# Altium project ecg-go_core.PrjPCB
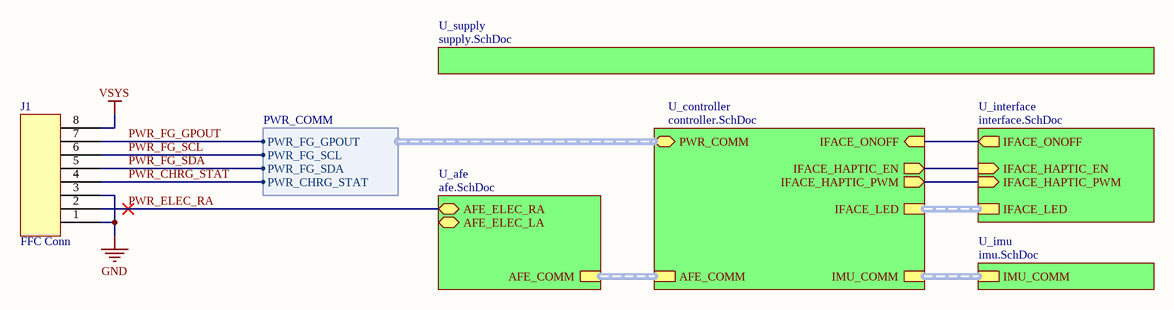
[diagram p0: core.SchDoc]
6 sheets, 84 parts. Net scope: hierarchical (ports join the sheet entries above them; power ports are global).
Board file: ecg-go_core.PcbDoc
Sheets:
  core.SchDoc
    U_afe = afe.SchDoc
    U_controller = controller.SchDoc
    U_imu = imu.SchDoc
    U_interface = interface.SchDoc
    U_supply = supply.SchDoc

## Sheet core.SchDoc: Core
size A4; Author: Samuel López; DocumentNumber: 1; SheetNumber: 1; SheetTotal: 6

### Parts
J1  FFC Conn  [WE68610814122]

### Sub-sheets
U_afe = afe.SchDoc: AFE_COMM (harness AFE_COMM), AFE_ELEC_RA (bidir), AFE_ELEC_LA (bidir)
U_controller = controller.SchDoc: IFACE_HAPTIC_EN (out), IFACE_HAPTIC_PWM (out), IFACE_ONOFF (in), IFACE_LED (harness IFACE_LED), AFE_COMM (harness AFE_COMM), IMU_COMM (harness IMU_COMM), PWR_COMM (harness PWR_COMM)
U_imu = imu.SchDoc: IMU_COMM (harness IMU_COMM)
U_interface = interface.SchDoc: IFACE_LED (harness IFACE_LED), IFACE_ONOFF (out), IFACE_HAPTIC_EN (in), IFACE_HAPTIC_PWM (in)
U_supply = supply.SchDoc: no entries

### Harnesses
PWR_COMM: PWR_FG_GPOUT, PWR_FG_SCL, PWR_FG_SDA, PWR_CHRG_STAT

### Nets
GND: J1.1 J1.3  [project net AGND]
VSYS: J1.8
IFACE_HAPTIC_EN: sheet U_controller/IFACE_HAPTIC_EN, sheet U_interface/IFACE_HAPTIC_EN
IFACE_HAPTIC_PWM: sheet U_controller/IFACE_HAPTIC_PWM, sheet U_interface/IFACE_HAPTIC_PWM
IFACE_ONOFF: sheet U_controller/IFACE_ONOFF, sheet U_interface/IFACE_ONOFF
PWR_CHRG_STAT: J1.4 ; sheet U_controller/PWR_COMM.PWR_CHRG_STAT
PWR_ELEC_RA: J1.2 ; sheet U_afe/AFE_ELEC_RA  [project net AFE_ELEC_RA]
PWR_FG_GPOUT: J1.7 ; sheet U_controller/PWR_COMM.PWR_FG_GPOUT
PWR_FG_SCL: J1.6 ; sheet U_controller/PWR_COMM.PWR_FG_SCL
PWR_FG_SDA: J1.5 ; sheet U_controller/PWR_COMM.PWR_FG_SDA

### Buses and harness runs
harness sheet U_afe/AFE_COMM = sheet U_controller/AFE_COMM
harness sheet U_controller/IFACE_LED = sheet U_interface/IFACE_LED
harness sheet U_controller/IMU_COMM = sheet U_imu/IMU_COMM

### Notes on the sheet
- Title:
- Sheet
- of
- Author:
- Date:
- Time:

### Library data of the parts
J1 = WE68610814122: Conn - FFC, 8 Pin, 1 mm Pitch, Top Contacts, SMD, Right Angle, Slide Lock; Supplier 1: Digi-Key; Supplier Part Number 1: 732-2003-1-ND

## Sheet afe.SchDoc: AFE
size A4; Author: Samuel López; DocumentNumber: 3; SheetNumber: 3; SheetTotal: 6
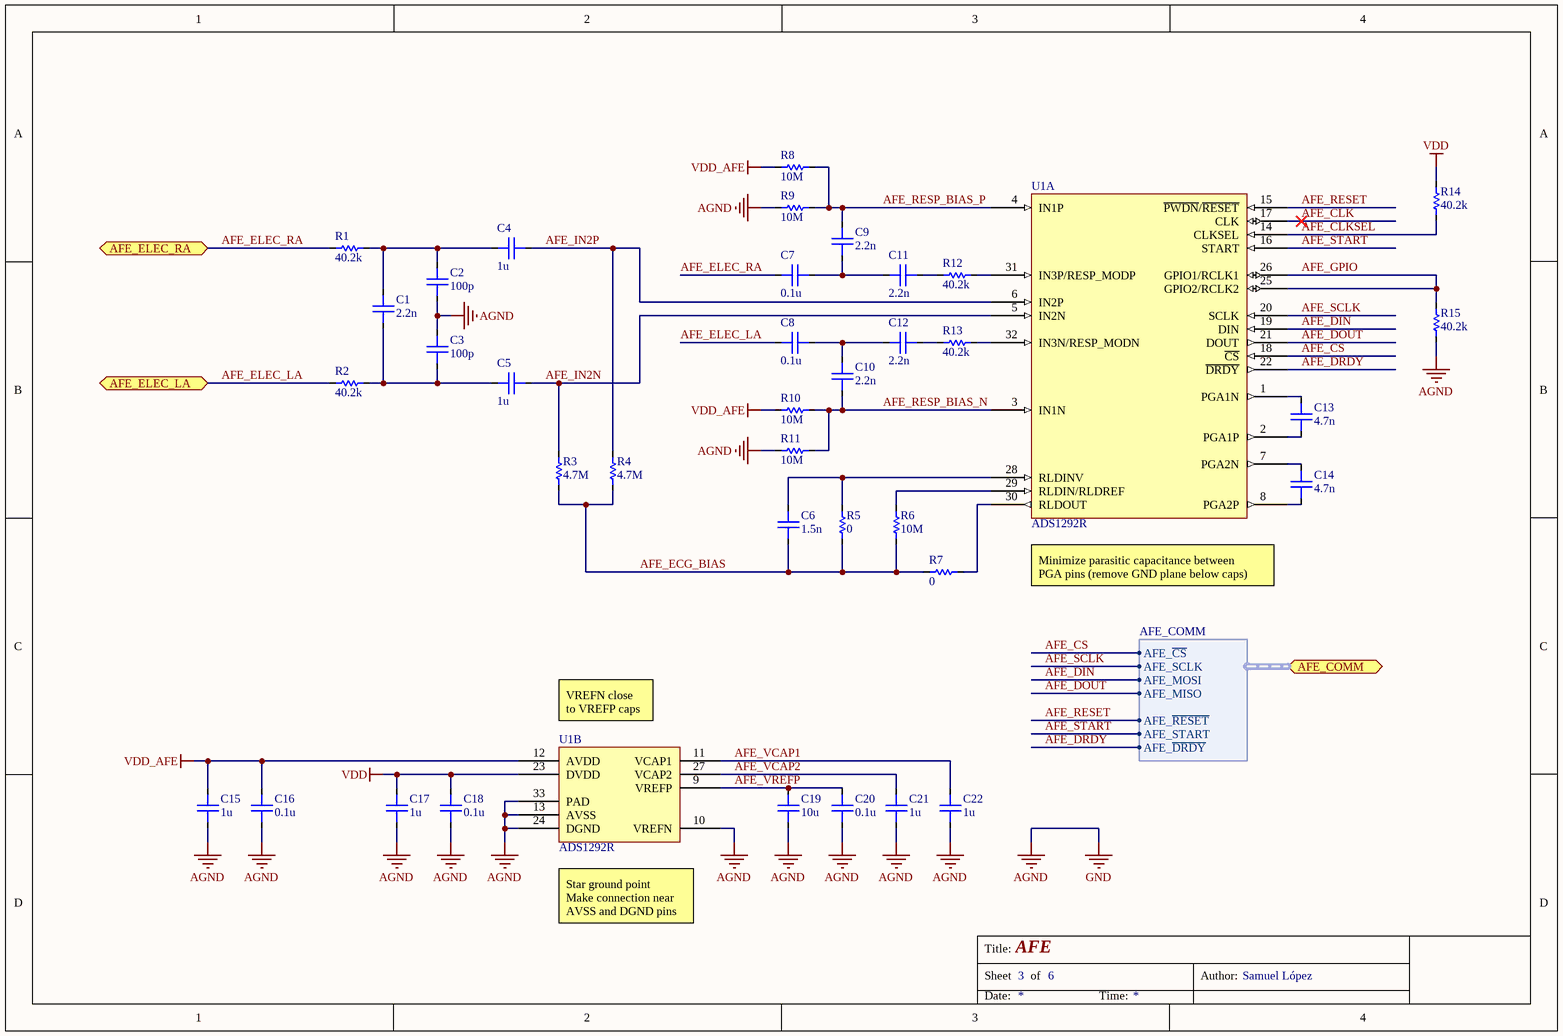
[diagram p1: afe.SchDoc]

### Parts
C1  2.2n  [C0402]
C2  100p  [C0402]
C3  100p  [C0402]
C4  1u  [C0402]
C5  1u  [C0402]
C6  1.5n  [C0402]
C7  0.1u  [C0402]
C8  0.1u  [C0402]
C9  2.2n  [C0402]
C10  2.2n  [C0402]
C11  2.2n  [C0402]
C12  2.2n  [C0402]
C13  4.7n  [C0402]
C14  4.7n  [C0402]
C15  1u  [C0402]
C16  0.1u  [C0402]
C17  1u  [C0402]
C18  0.1u  [C0402]
C19  10u  [C0603]
C20  0.1u  [C0402]
C21  1u  [C0402]
C22  1u  [C0402]
R1  40.2k  [R0402]
R2  40.2k  [R0402]
R3  4.7M  [R0402]
R4  4.7M  [R0402]
R5  0  [R0402]
R6  10M  [R0402]
R7  0  [R0402]
R8  10M  [R0402]
R9  10M  [R0402]
R10  10M  [R0402]
R11  10M  [R0402]
R12  40.2k  [R0402]
R13  40.2k  [R0402]
R14  40.2k  [R0402]
R15  40.2k  [R0402]
U1  ADS1292R  [ADS129x_QFN]  (parts A,B of 2)

### Ports
AFE_COMM (harness AFE_COMM), AFE_ELEC_LA (bidir), AFE_ELEC_RA (bidir)

### Harnesses
AFE_COMM: AFE_SCLK, AFE_MOSI, AFE_MISO, AFE_~{CS}, AFE_~{RESET}, AFE_START, AFE_~{DRDY}

### Nets
AGND: C2.2 C3.1 C15.1 C16.1 C17.1 C18.1 C19.1 C20.1 C21.1 C22.1 R9.2 R11.2 R15.1 U1.10(VREFN) U1.13(AVSS) U1.24(DGND) U1.33(PAD)  [also labelled GND]
VDD: C17.2 C18.2 R14.2 U1.23(DVDD)
VDD_AFE: C15.2 C16.2 R8.2 R10.2 U1.12(AVDD)
AFE_CLK: U1.17(CLK)
AFE_CLKSEL: R14.1 U1.14(CLKSEL)
AFE_CS: U1.18(~{CS}) ; port AFE_COMM.AFE_~{CS}
AFE_DIN: U1.19(DIN) ; port AFE_COMM.AFE_MOSI
AFE_DOUT: U1.21(DOUT) ; port AFE_COMM.AFE_MISO
AFE_DRDY: U1.22(~{DRDY}) ; port AFE_COMM.AFE_~{DRDY}
AFE_ECG_BIAS: C6.1 R3.1 R4.1 R5.1 R6.1 R7.2
AFE_ELEC_LA: C8.1 R2.2 ; port AFE_ELEC_LA
AFE_ELEC_RA: C7.2 R1.2 ; port AFE_ELEC_RA
AFE_GPIO: R15.2 U1.25(GPIO2/RCLK2) U1.26(GPIO1/RCLK1)
AFE_IN2N: C5.2 R3.2 U1.5(IN2N)
AFE_IN2P: C4.2 R4.2 U1.6(IN2P)
AFE_RESET: U1.15(~{PWDN}/~{RESET}) ; port AFE_COMM.AFE_~{RESET}
AFE_RESP_BIAS_N: C10.1 R10.1 R11.1 U1.3(IN1N)
AFE_RESP_BIAS_P: C9.1 R8.1 R9.1 U1.4(IN1P)
AFE_SCLK: U1.20(SCLK) ; port AFE_COMM.AFE_SCLK
AFE_START: U1.16(START) ; port AFE_COMM.AFE_START
AFE_VCAP1: C22.2 U1.11(VCAP1)
AFE_VCAP2: C21.2 U1.27(VCAP2)
AFE_VREFP: C19.2 C20.2 U1.9(VREFP)
NetC1_1: C1.1 C2.1 C4.1 R1.1
NetC1_2: C1.2 C3.2 C5.1 R2.1
NetC6_2: C6.2 R5.2 U1.28(RLDINV)
NetC7_1: C7.1 C9.2 C11.2
NetC8_2: C8.2 C10.2 C12.1
NetC11_1: C11.1 R12.2
NetC12_2: C12.2 R13.2
NetC13_1: C13.1 U1.2(PGA1P)
NetC13_2: C13.2 U1.1(PGA1N)
NetC14_1: C14.1 U1.8(PGA2P)
NetC14_2: C14.2 U1.7(PGA2N)
NetR6_2: R6.2 U1.29(RLDIN/RLDREF)
NetR7_1: R7.1 U1.30(RLDOUT)
NetR12_1: R12.1 U1.31(IN3P/RESP_MODP)
NetR13_1: R13.1 U1.32(IN3N/RESP_MODN)

### Notes on the sheet
- Minimize parasitic capacitance between
  PGA pins (remove GND plane below caps)
- (near U1) VREFN close
  to VREFP caps
- (near U1) Star ground point
  Make connection near AVSS and DGND pins
- Title:
- Sheet
- of
- Author:
- Date:
- Time:

### Library data of the parts
C1-C22 = Capacitor: Rated Voltage: *
  C1 C9-C12: Value: 2.2n
  C2 C3: Value: 100p
  C4 C5 C15 C17 C21 C22: Value: 1u
  C6: Value: 1.5n
  C7 C8 C16 C18 C20: Value: 0.1u
  C13 C14: Value: 4.7n
  C19: Value: 10u
R1-R15 = Resistor: Power: *
  R1 R2 R12-R15: Value: 40.2k
  R3 R4: Value: 4.7M
  R5 R7: Value: 0
  R6 R8-R11: Value: 10M
U1 = ADS1292R: IC - Analog Front End - Medical; Supplier 1: Digi-Key; Supplier Part Number 1: 296-35020-1-ND

## Sheet controller.SchDoc: Controller
size A4; Author: Samuel López; DocumentNumber: 2; SheetNumber: 2; SheetTotal: 6
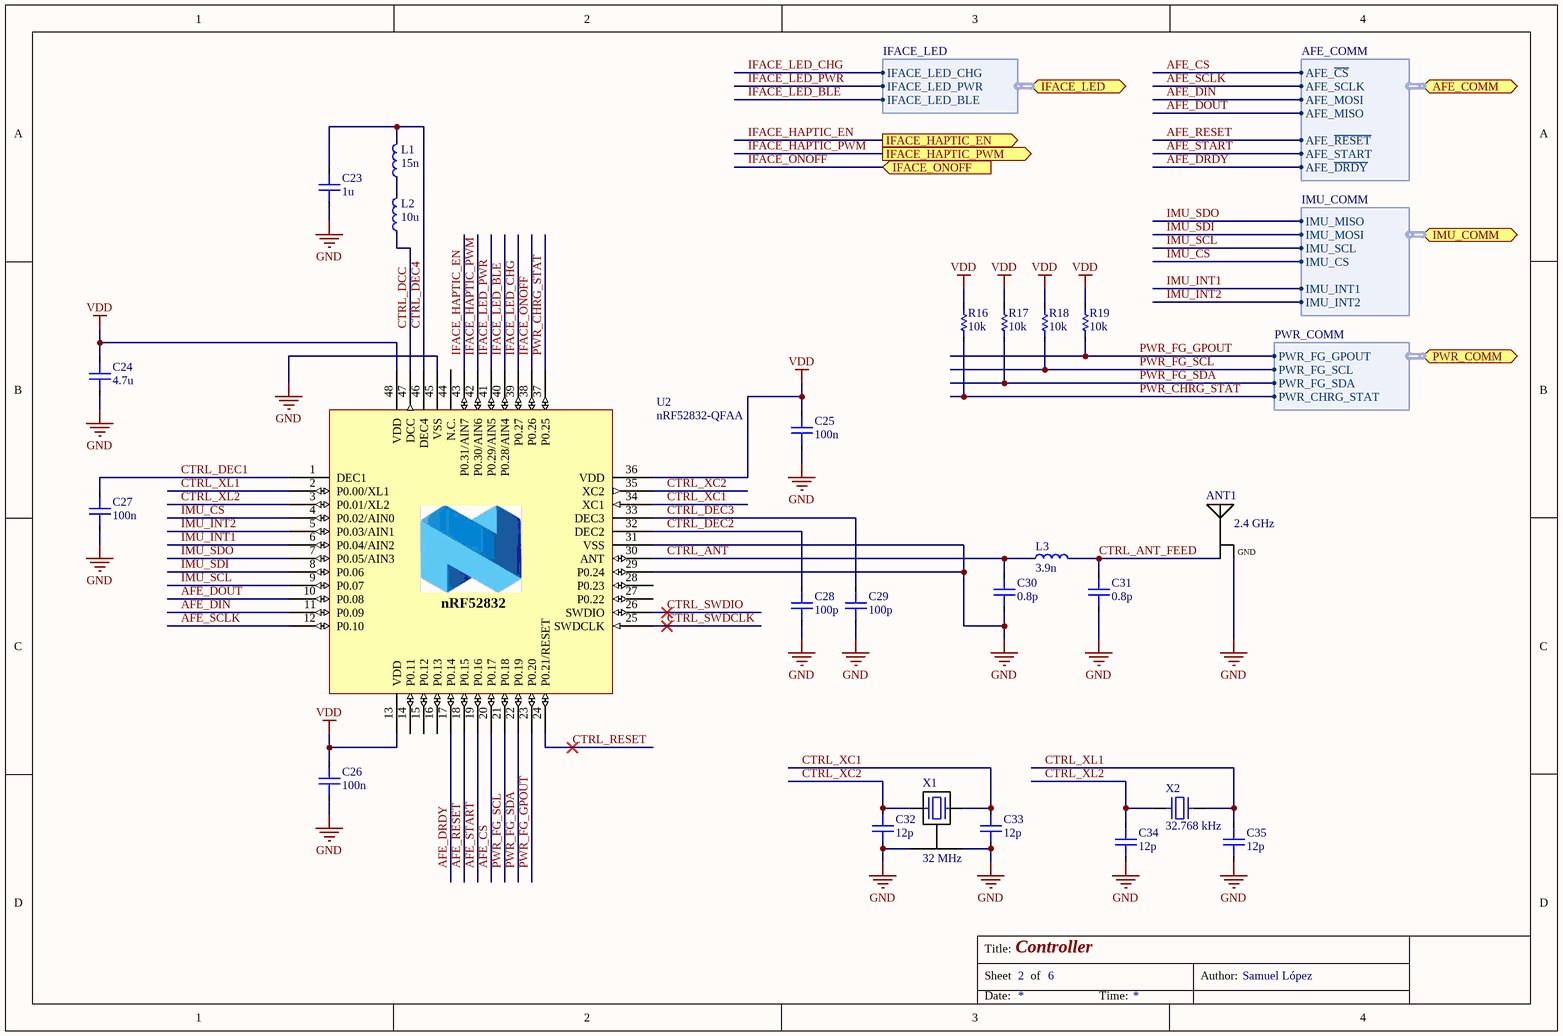
[diagram p2: controller.SchDoc]

### Parts
ANT1  2.4 GHz  [ANT2.4GHZ_MIFA]  (net tie, no BOM)
C23  1u  [C0402]
C24  4.7u  [C0603]
C25  100n  [C0402]
C26  100n  [C0402]
C27  100n  [C0402]
C28  100p  [C0402]
C29  100p  [C0402]
C30  0.8p  [C0402]
C31  0.8p  [C0402]
C32  12p  [C0402]
C33  12p  [C0402]
C34  12p  [C0402]
C35  12p  [C0402]
L1  15n  [L0402]
L2  10u  [L0603]
L3  3.9n  [L0402]
R16  10k  [R0402]
R17  10k  [R0402]
R18  10k  [R0402]
R19  10k  [R0402]
U2  nRF52832-QFAA  [QFN40P600X600X90-48N]
X1  32 MHz  [CX2016DB32000D0FLJCC]
X2  32.768 kHz  [ABS07-32.768KHZ-9-T]

### Ports
AFE_COMM (harness AFE_COMM), IFACE_HAPTIC_EN (out), IFACE_HAPTIC_PWM (out), IFACE_LED (harness IFACE_LED), IFACE_ONOFF (in), IMU_COMM (harness IMU_COMM), PWR_COMM (harness PWR_COMM)

### Harnesses
IFACE_LED: IFACE_LED_CHG, IFACE_LED_PWR, IFACE_LED_BLE
AFE_COMM: AFE_SCLK, AFE_MOSI, AFE_MISO, AFE_~{CS}, AFE_~{RESET}, AFE_START, AFE_~{DRDY}
IMU_COMM: IMU_SCL, IMU_MOSI, IMU_MISO, IMU_CS, IMU_INT1, IMU_INT2
PWR_COMM: PWR_FG_GPOUT, PWR_FG_SCL, PWR_FG_SDA, PWR_CHRG_STAT

### Nets
GND: ANT1.2(GND) C23.1 C24.1 C25.1 C26.1 C27.1 C28.1 C29.1 C30.2 C31.2 C32.1 C33.1 C34.1 C35.1 U2.29(P0.24) U2.31(VSS) U2.45(VSS) U2.49(GND) X1.2 X1.4  [project net AGND]
VDD: C24.2 C25.2 C26.2 R16.2 R17.2 R18.2 R19.2 U2.13(VDD) U2.36(VDD) U2.48(VDD)
AFE_CS: U2.20(P0.17) ; port AFE_COMM.AFE_~{CS}
AFE_DIN: U2.11(P0.09) ; port AFE_COMM.AFE_MOSI
AFE_DOUT: U2.10(P0.08) ; port AFE_COMM.AFE_MISO
AFE_DRDY: U2.17(P0.14) ; port AFE_COMM.AFE_~{DRDY}
AFE_RESET: U2.18(P0.15) ; port AFE_COMM.AFE_~{RESET}
AFE_SCLK: U2.12(P0.10) ; port AFE_COMM.AFE_SCLK
AFE_START: U2.19(P0.16) ; port AFE_COMM.AFE_START
CTRL_ANT: C30.1 L3.1 U2.30(ANT)
CTRL_ANT_FEED: ANT1.1(IN) C31.1 L3.2
CTRL_DCC: L2.1 U2.47(DCC)
CTRL_DEC1: C27.2 U2.1(DEC1)
CTRL_DEC2: C28.2 U2.32(DEC2)
CTRL_DEC3: C29.2 U2.33(DEC3)
CTRL_DEC4: C23.2 L1.2 U2.46(DEC4)
CTRL_RESET: U2.24(P0.21/RESET)
CTRL_SWDCLK: U2.25(SWDCLK)
CTRL_SWDIO: U2.26(SWDIO)
CTRL_XC1: C33.2 U2.34(XC1) X1.3
CTRL_XC2: C32.2 U2.35(XC2) X1.1
CTRL_XL1: C35.2 U2.2(P0.00/XL1) X2.2
CTRL_XL2: C34.2 U2.3(P0.01/XL2) X2.1
IFACE_HAPTIC_EN: U2.43(P0.31/AIN7) ; port IFACE_HAPTIC_EN
IFACE_HAPTIC_PWM: U2.42(P0.30/AIN6) ; port IFACE_HAPTIC_PWM
IFACE_LED_BLE: U2.40(P0.28/AIN4) ; port IFACE_LED.IFACE_LED_BLE
IFACE_LED_CHG: U2.39(P0.27) ; port IFACE_LED.IFACE_LED_CHG
IFACE_LED_PWR: U2.41(P0.29/AIN5) ; port IFACE_LED.IFACE_LED_PWR
IFACE_ONOFF: U2.38(P0.26) ; port IFACE_ONOFF
IMU_CS: U2.4(P0.02/AIN0) ; port IMU_COMM.IMU_CS
IMU_INT1: U2.6(P0.04/AIN2) ; port IMU_COMM.IMU_INT1
IMU_INT2: U2.5(P0.03/AIN1) ; port IMU_COMM.IMU_INT2
IMU_SCL: U2.9(P0.07) ; port IMU_COMM.IMU_SCL
IMU_SDI: U2.8(P0.06) ; port IMU_COMM.IMU_MOSI
IMU_SDO: U2.7(P0.05/AIN3) ; port IMU_COMM.IMU_MISO
PWR_CHRG_STAT: R16.1 U2.37(P0.25) ; port PWR_COMM.PWR_CHRG_STAT
PWR_FG_GPOUT: R19.1 U2.23(P0.20) ; port PWR_COMM.PWR_FG_GPOUT
PWR_FG_SCL: R18.1 U2.21(P0.18) ; port PWR_COMM.PWR_FG_SCL
PWR_FG_SDA: R17.1 U2.22(P0.19) ; port PWR_COMM.PWR_FG_SDA
NetL1_1: L1.1 L2.2

Not connected (* = marked no-connect by the designer): U2 14(P0.11) 15(P0.12) 16(P0.13) 27(P0.22) 28(P0.23) 44(N.C.)

### Notes on the sheet
- Title:
- Sheet
- of
- Author:
- Date:
- Time:
- (in symbol nRF52832_QFAA) nRF52832

### Library data of the parts
ANT1 = Antenna 2.4 GHz: Antenna - Meandered Inverted F Antenna (IFA)
C23-C35 = Capacitor: Rated Voltage: *
  C23: Value: 1u
  C24: Value: 4.7u
  C25-C27: Value: 100n
  C28 C29: Value: 100p
  C30 C31: Value: 0.8p
  C32-C35: Value: 12p
L1-L3 = Inductor
  L1: Value: 15n
  L2: Value: 10u
  L3: Value: 3.9n
R16-R19 = Resistor: Value: 10k; Power: *
U2 = nRF52832_QFAA: Multi-protocol Bluetooth Low Energy, ANT and 2.4GHz proprietary system-on-chip; Manufacturer: Nordic Semiconductor; Artikkelnr Noca: N.A.; Part Number: nRF52832-QFAA; Manufacturer Part Number: nRF52832-QFAA; Datasheet: *; LatestRevisionDate: 2014-11-26; Pin Count: 48; Publisher: Nordic Semiconductor; Published: 2014-11-26; Value: nRF52832-QFAA; Note: *; Supplier: Nordic Semiconductor; Supplier part number: *; 2nd source Supplier: *; 2nd source part number: *; Footprint Doc: QFN-48; Artikkelnr Simpro: N.A.
X1 = CX2016DB32000D0FLJCC: Crystal - 32 MHz, 8 pF, 80 ohm; Supplier 1: Digi-Key; Supplier Part Number 1: 1253-1118-1-ND
X2 = ABS07-32.768KHZ-9-T: Crystal - 32.768 kHz, 9 pF, 70 kOhm; Supplier 1: Digi-Key; Supplier Part Number 1: 535-9544-1-ND

## Sheet imu.SchDoc: Inertial Measurement Unit
size A4; Author: Samuel López; DocumentNumber: 4; SheetNumber: 4; SheetTotal: 6
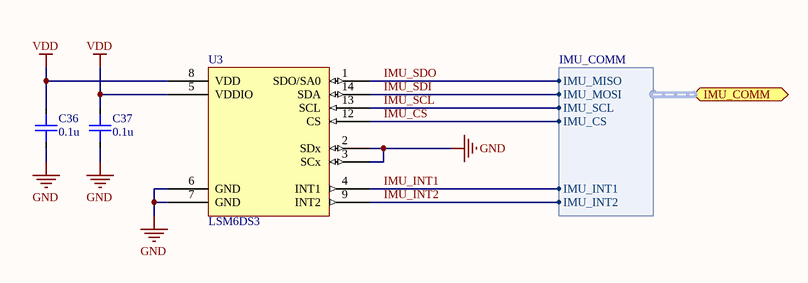
[diagram p3: imu.SchDoc]

### Parts
C36  0.1u  [C0402]
C37  0.1u  [C0402]
U3  LSM6DS3  [LSM6DS3]

### Ports
IMU_COMM (harness IMU_COMM)

### Harnesses
IMU_COMM: IMU_SCL, IMU_MOSI, IMU_MISO, IMU_CS, IMU_INT1, IMU_INT2

### Nets
GND: C36.1 C37.1 U3.2(SDx) U3.3(SCx) U3.6(GND) U3.7(GND)  [project net AGND]
VDD: C36.2 C37.2 U3.5(VDDIO) U3.8(VDD)
IMU_CS: U3.12(CS) ; port IMU_COMM.IMU_CS
IMU_INT1: U3.4(INT1) ; port IMU_COMM.IMU_INT1
IMU_INT2: U3.9(INT2) ; port IMU_COMM.IMU_INT2
IMU_SCL: U3.13(SCL) ; port IMU_COMM.IMU_SCL
IMU_SDI: U3.14(SDA) ; port IMU_COMM.IMU_MOSI
IMU_SDO: U3.1(SDO/SA0) ; port IMU_COMM.IMU_MISO

### Notes on the sheet
- Title:
- Sheet
- of
- Author:
- Date:
- Time:

### Library data of the parts
C36 C37 = Capacitor: Value: 0.1u; Rated Voltage: *
U3 = LSM6DS3: IC - Inertial Measurement Unit, Accelerometer, Gyroscope, 6D; Supplier 1: Digi-Key; Supplier Part Number 1: 497-15383-1-ND

## Sheet interface.SchDoc: User interface
size A4; Author: Samuel López; DocumentNumber: 5; SheetNumber: 5; SheetTotal: 6
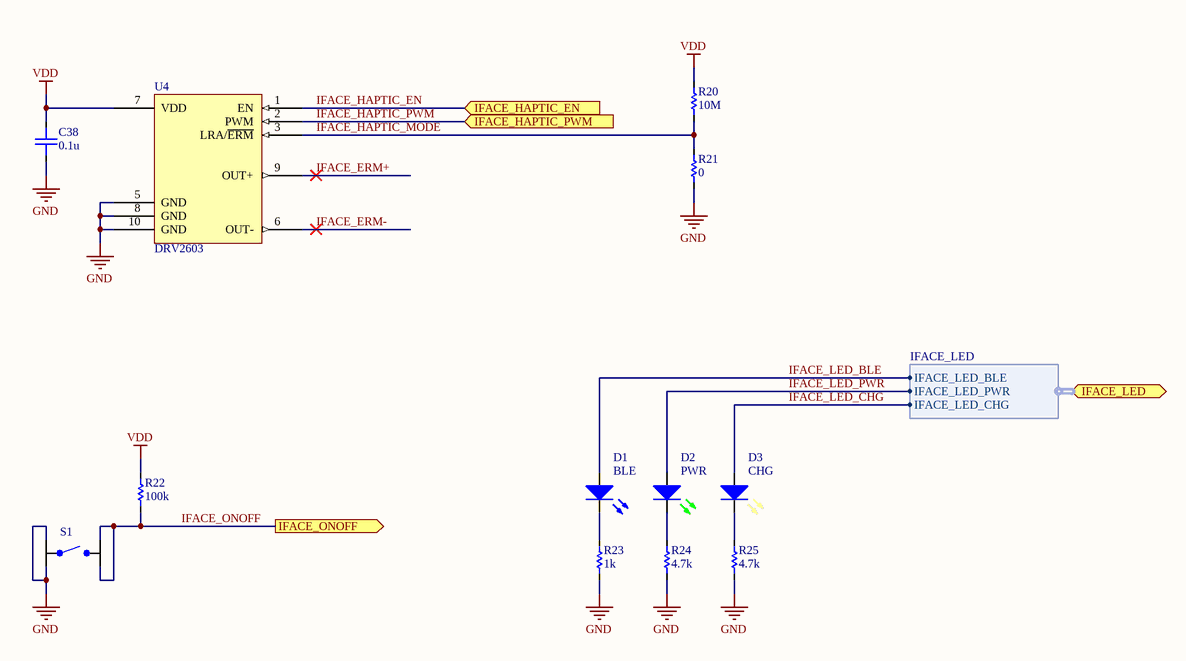
[diagram p4: interface.SchDoc]

### Parts
C38  0.1u  [C0402]
D1  BLE  [WL-SMCW 0603]
D2  PWR  [WL-SMCW 0603]
D3  CHG  [WL-SMCW 0603]
R20  10M  [R0402]
R21  0  [R0402]
R22  100k  [R0402]
R23  1k  [R0402]
R24  4.7k  [R0402]
R25  4.7k  [R0402]
S1  WE434351045816  [WE434351045816]  (value not drawn)
U4  DRV2603  [DRV2603]

### Ports
IFACE_HAPTIC_EN (in), IFACE_HAPTIC_PWM (in), IFACE_LED (harness IFACE_LED), IFACE_ONOFF (out)

### Harnesses
IFACE_LED: IFACE_LED_CHG, IFACE_LED_PWR, IFACE_LED_BLE

### Nets
GND: C38.1 R21.1 R23.1 R24.1 R25.1 S1.1 S1.3 U4.5(GND) U4.8(GND) U4.10(GND)  [project net AGND]
VDD: C38.2 R20.2 R22.2 U4.7(VDD)
IFACE_ERM+: U4.9(OUT+)
IFACE_ERM-: U4.6(OUT-)
IFACE_HAPTIC_EN: U4.1(EN) ; port IFACE_HAPTIC_EN
IFACE_HAPTIC_MODE: R20.1 R21.2 U4.3(LRA/~{ERM})
IFACE_HAPTIC_PWM: U4.2(PWM) ; port IFACE_HAPTIC_PWM
IFACE_LED_BLE: D1.2(A) ; port IFACE_LED.IFACE_LED_BLE
IFACE_LED_CHG: D3.2(A) ; port IFACE_LED.IFACE_LED_CHG
IFACE_LED_PWR: D2.2(A) ; port IFACE_LED.IFACE_LED_PWR
IFACE_ONOFF: R22.1 S1.2 S1.4 ; port IFACE_ONOFF
NetD1_1: D1.1(K) R23.2
NetD2_1: D2.1(K) R24.2
NetD3_1: D3.1(K) R25.2

### Notes on the sheet
- Title:
- Sheet
- of
- Author:
- Date:
- Time:

### Library data of the parts
C38 = Capacitor: Value: 0.1u; Rated Voltage: *
D1 = 150060BS75000: LED - Blue, 3.2V, 0603; Supplier 1: Digi-Key; Supplier Part Number 1: 732-4966-1-ND
D2 = 150060VS75000: LED - Green, 2V, 0603; Supplier 1: Digi-Key; Supplier Part Number 1: 732-4980-1-ND
D3 = 150060YS75000: LED - Yellow, 2V, 0603; Supplier 1: Digi-Key; Supplier Part Number 1: 732-4981-1-ND
R20-R25 = Resistor: Power: *
  R20: Value: 10M
  R21: Value: 0
  R22: Value: 100k
  R23: Value: 1k
  R24 R25: Value: 4.7k
S1 = WE434351045816: Switch - Tactile, Off-Mom, SPST, Side-Actuated; Supplier 1: Digi-Key; Supplier Part Number 1: 732-7057-1-ND
U4 = DRV2603: IC - Haptic Drive, ERM/LRA, Auto Resonance; Supplier 1: Digi-Key; Supplier Part Number 1: 296-30613-1-ND

## Sheet supply.SchDoc: Supply regulation
size A4; Author: Samuel López; DocumentNumber: 6; SheetNumber: 6; SheetTotal: 6
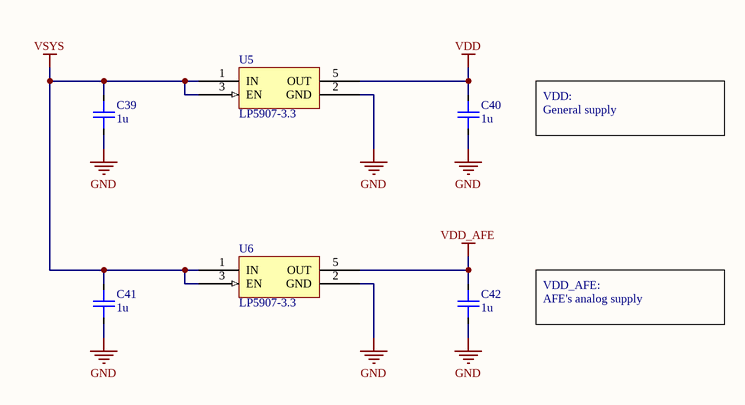
[diagram p5: supply.SchDoc]

### Parts
C39  1u  [C0402]
C40  1u  [C0402]
C41  1u  [C0402]
C42  1u  [C0402]
U5  LP5907-3.3  [LP5907]
U6  LP5907-3.3  [LP5907]

### Nets
GND: C39.1 C40.1 C41.1 C42.1 U5.2(GND) U6.2(GND)  [project net AGND]
VDD: C40.2 U5.5(OUT)
VDD_AFE: C42.2 U6.5(OUT)
VSYS: C39.2 C41.2 U5.1(IN) U5.3(EN) U6.1(IN) U6.3(EN)

### Notes on the sheet
- VDD:
  General supply
- VDD_AFE:
  AFE's analog supply
- Title:
- Sheet
- of
- Author:
- Date:
- Time:

### Library data of the parts
C39-C42 = Capacitor: Value: 1u; Rated Voltage: *
U5 U6 = LP5907-3.3: IC - Voltage Regulator, Linear; Supplier 1: Digi-Key; Supplier Part Number 1: 296-38557-1-ND

## Nets that join several sheets
AGND: core (J1.1 J1.3), afe (17 pins), controller (20 pins), imu (6 pins), interface (10 pins), supply (6 pins)
VDD: afe (C17.2 C18.2 R14.2 U1.23), controller (10 pins), imu (C36.2 C37.2 U3.5 U3.8), interface (C38.2 R20.2 R22.2 U4.7), supply (C40.2 U5.5)
VDD_AFE: afe (5 pins), supply (C42.2 U6.5)
VSYS: core (J1.8), supply (6 pins)
AFE_CS: afe (U1.18), controller (U2.20)
AFE_DIN: afe (U1.19), controller (U2.11)
AFE_DOUT: afe (U1.21), controller (U2.10)
AFE_DRDY: afe (U1.22), controller (U2.17)
AFE_ELEC_RA: core (J1.2), afe (C7.2 R1.2)
AFE_RESET: afe (U1.15), controller (U2.18)
AFE_SCLK: afe (U1.20), controller (U2.12)
AFE_START: afe (U1.16), controller (U2.19)
IFACE_HAPTIC_EN: controller (U2.43), interface (U4.1)
IFACE_HAPTIC_PWM: controller (U2.42), interface (U4.2)
IFACE_LED_BLE: controller (U2.40), interface (D1.2)
IFACE_LED_CHG: controller (U2.39), interface (D3.2)
IFACE_LED_PWR: controller (U2.41), interface (D2.2)
IFACE_ONOFF: controller (U2.38), interface (R22.1 S1.2 S1.4)
IMU_CS: controller (U2.4), imu (U3.12)
IMU_INT1: controller (U2.6), imu (U3.4)
IMU_INT2: controller (U2.5), imu (U3.9)
IMU_SCL: controller (U2.9), imu (U3.13)
IMU_SDI: controller (U2.8), imu (U3.14)
IMU_SDO: controller (U2.7), imu (U3.1)
PWR_CHRG_STAT: core (J1.4), controller (R16.1 U2.37)
PWR_FG_GPOUT: core (J1.7), controller (R19.1 U2.23)
PWR_FG_SCL: core (J1.6), controller (R18.1 U2.21)
PWR_FG_SDA: core (J1.5), controller (R17.1 U2.22)

## Assembly variants
Release: not fitted C6 C28 C31 R6 R20